# EAGLE schematic MMI (EAGLE 6.4)
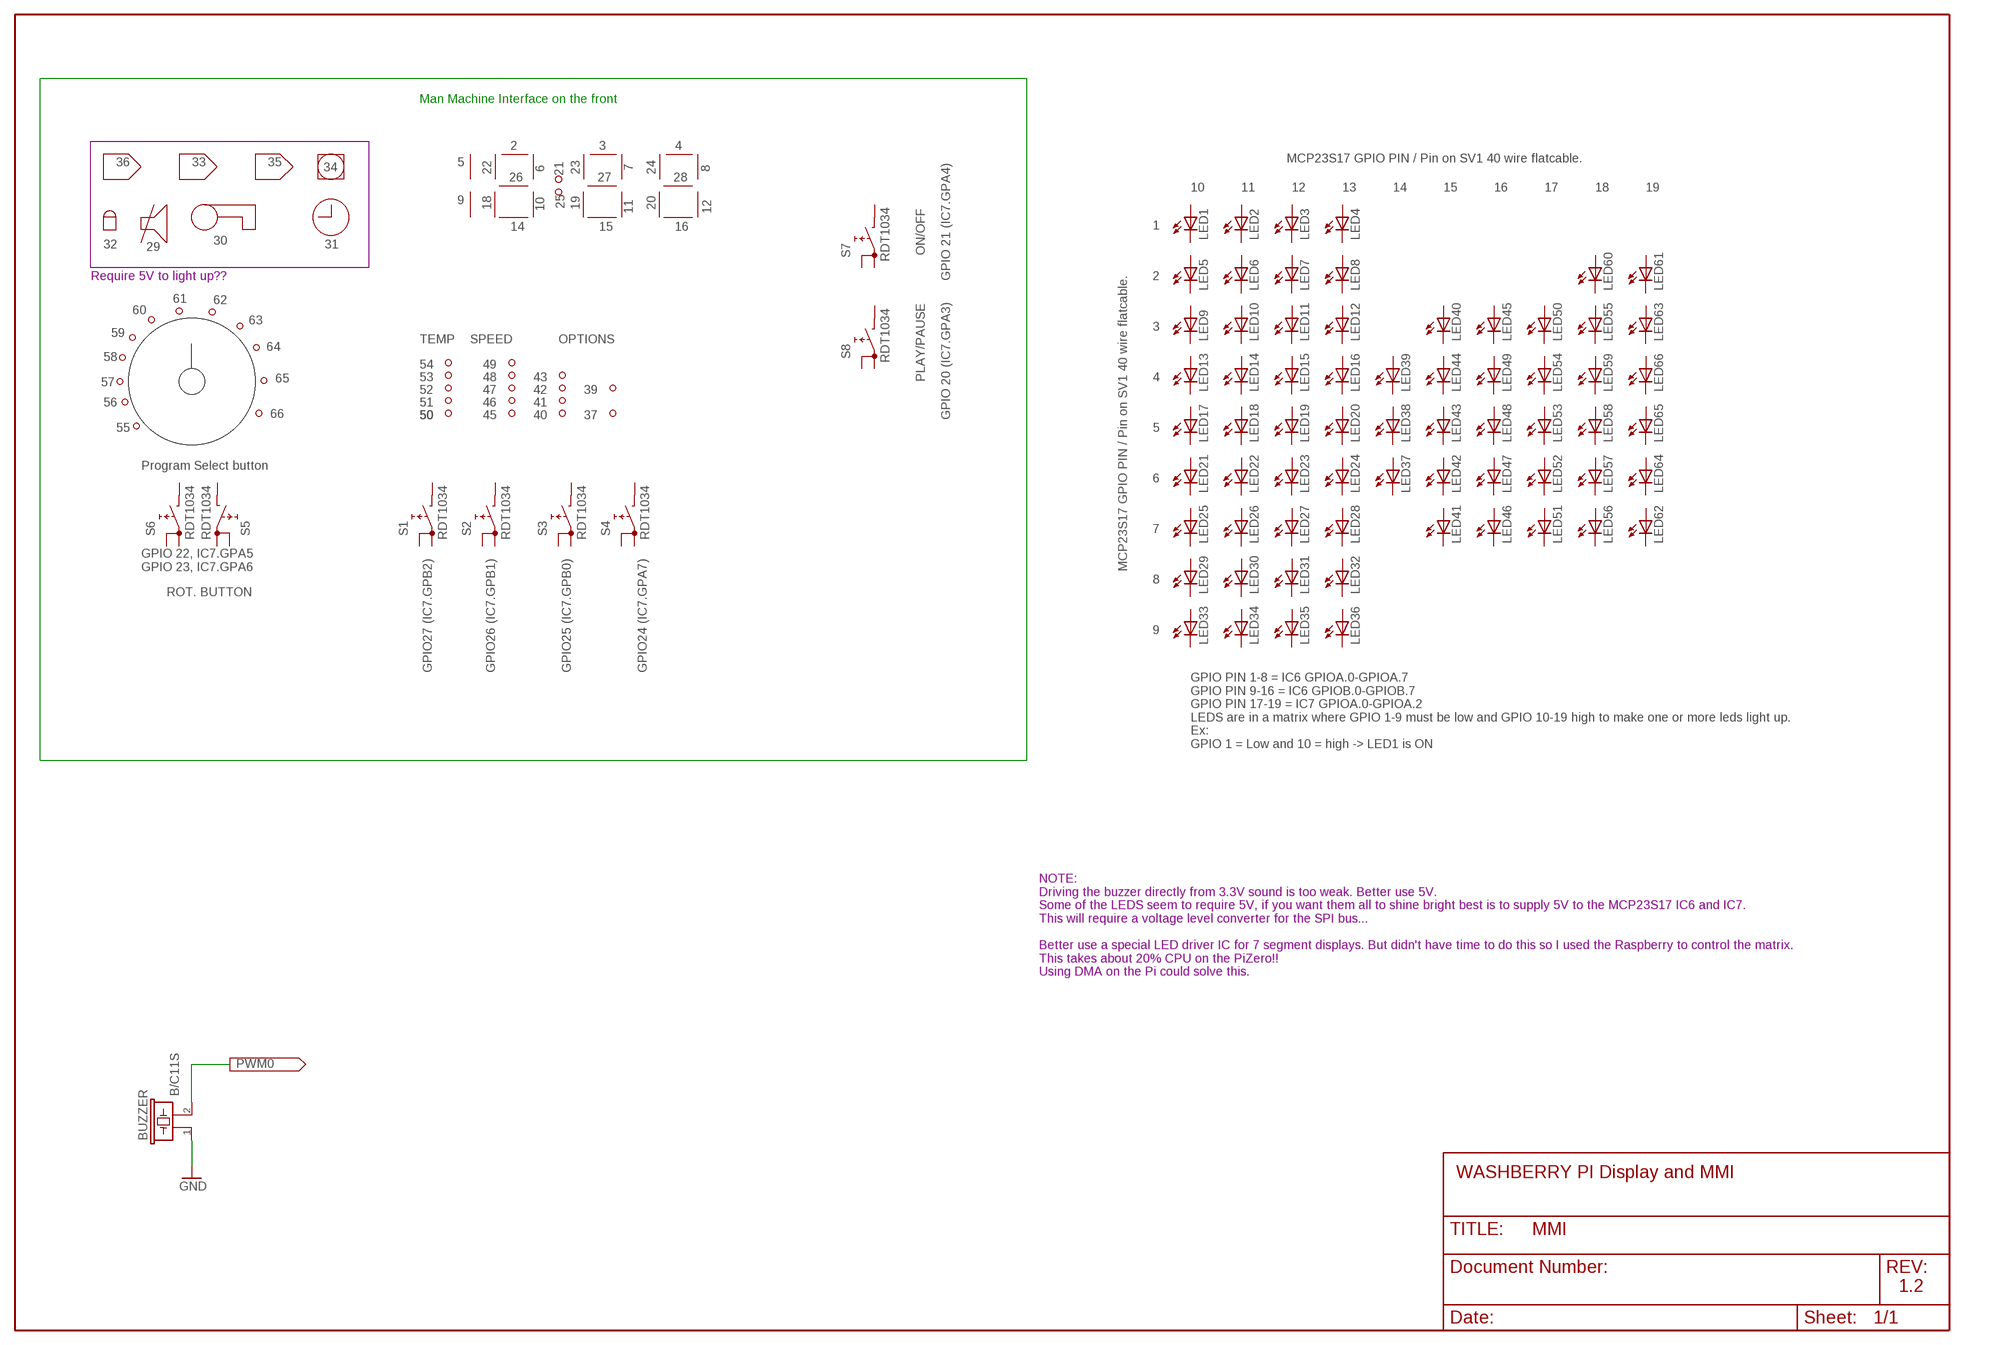
[diagram p0: schematic, sheet 1]

## Parts
BUZZER  B/C11S  [B/C11S]
LED1  LED3MM  [LED3MM]
LED2  LED3MM  [LED3MM]
LED3  LED3MM  [LED3MM]
LED4  LED3MM  [LED3MM]
LED5  LED3MM  [LED3MM]
LED6  LED3MM  [LED3MM]
LED7  LED3MM  [LED3MM]
LED8  LED3MM  [LED3MM]
LED9  LED3MM  [LED3MM]
LED10  LED3MM  [LED3MM]
LED11  LED3MM  [LED3MM]
LED12  LED3MM  [LED3MM]
LED13  LED3MM  [LED3MM]
LED14  LED3MM  [LED3MM]
LED15  LED3MM  [LED3MM]
LED16  LED3MM  [LED3MM]
LED17  LED3MM  [LED3MM]
LED18  LED3MM  [LED3MM]
LED19  LED3MM  [LED3MM]
LED20  LED3MM  [LED3MM]
LED21  LED3MM  [LED3MM]
LED22  LED3MM  [LED3MM]
LED23  LED3MM  [LED3MM]
LED24  LED3MM  [LED3MM]
LED25  LED3MM  [LED3MM]
LED26  LED3MM  [LED3MM]
LED27  LED3MM  [LED3MM]
LED28  LED3MM  [LED3MM]
LED29  LED3MM  [LED3MM]
LED30  LED3MM  [LED3MM]
LED31  LED3MM  [LED3MM]
LED32  LED3MM  [LED3MM]
LED33  LED3MM  [LED3MM]
LED34  LED3MM  [LED3MM]
LED35  LED3MM  [LED3MM]
LED36  LED3MM  [LED3MM]
LED37  LED3MM  [LED3MM]
LED38  LED3MM  [LED3MM]
LED39  LED3MM  [LED3MM]
LED40  LED3MM  [LED3MM]
LED41  LED3MM  [LED3MM]
LED42  LED3MM  [LED3MM]
LED43  LED3MM  [LED3MM]
LED44  LED3MM  [LED3MM]
LED45  LED3MM  [LED3MM]
LED46  LED3MM  [LED3MM]
LED47  LED3MM  [LED3MM]
LED48  LED3MM  [LED3MM]
LED49  LED3MM  [LED3MM]
LED50  LED3MM  [LED3MM]
LED51  LED3MM  [LED3MM]
LED52  LED3MM  [LED3MM]
LED53  LED3MM  [LED3MM]
LED54  LED3MM  [LED3MM]
LED55  LED3MM  [LED3MM]
LED56  LED3MM  [LED3MM]
LED57  LED3MM  [LED3MM]
LED58  LED3MM  [LED3MM]
LED59  LED3MM  [LED3MM]
LED60  LED3MM  [LED3MM]
LED61  LED3MM  [LED3MM]
LED62  LED3MM  [LED3MM]
LED63  LED3MM  [LED3MM]
LED64  LED3MM  [LED3MM]
LED65  LED3MM  [LED3MM]
LED66  LED3MM  [LED3MM]
S1  RDT1034  [RDT1034]
S2  RDT1034  [RDT1034]
S3  RDT1034  [RDT1034]
S4  RDT1034  [RDT1034]
S5  RDT1034  [RDT1034]
S6  RDT1034  [RDT1034]
S7  RDT1034  [RDT1034]
S8  RDT1034  [RDT1034]

## Nets
GND: BUZZER.1
N$1: BUZZER.2
Unconnected: LED1.A LED1.K(C) LED2.A LED2.K(C) LED3.A LED3.K(C) LED4.A LED4.K(C) LED5.A LED5.K(C) LED6.A LED6.K(C) LED7.A LED7.K(C) LED8.A LED8.K(C) LED9.A LED9.K(C) LED10.A LED10.K(C) LED11.A LED11.K(C) LED12.A LED12.K(C) LED13.A LED13.K(C) LED14.A LED14.K(C) LED15.A LED15.K(C) LED16.A LED16.K(C) LED17.A LED17.K(C) LED18.A LED18.K(C) LED19.A LED19.K(C) LED20.A LED20.K(C) LED21.A LED21.K(C) LED22.A LED22.K(C) LED23.A LED23.K(C) LED24.A LED24.K(C) LED25.A LED25.K(C) LED26.A LED26.K(C) LED27.A LED27.K(C) LED28.A LED28.K(C) LED29.A LED29.K(C) LED30.A LED30.K(C) LED31.A LED31.K(C) LED32.A LED32.K(C) LED33.A LED33.K(C) LED34.A LED34.K(C) LED35.A LED35.K(C) LED36.A LED36.K(C) LED37.A LED37.K(C) LED38.A LED38.K(C) LED39.A LED39.K(C) LED40.A LED40.K(C) LED41.A LED41.K(C) LED42.A LED42.K(C) LED43.A LED43.K(C) LED44.A LED44.K(C) LED45.A LED45.K(C) LED46.A LED46.K(C) LED47.A LED47.K(C) LED48.A LED48.K(C) LED49.A LED49.K(C) LED50.A LED50.K(C) LED51.A LED51.K(C) LED52.A LED52.K(C) LED53.A LED53.K(C) LED54.A LED54.K(C) LED55.A LED55.K(C) LED56.A LED56.K(C) LED57.A LED57.K(C) LED58.A LED58.K(C) LED59.A LED59.K(C) LED60.A LED60.K(C) LED61.A LED61.K(C) LED62.A LED62.K(C) LED63.A LED63.K(C) LED64.A LED64.K(C) LED65.A LED65.K(C) LED66.A LED66.K(C) S1.A S1.A1 S1.B S2.A S2.A1 S2.B S3.A S3.A1 S3.B S4.A S4.A1 S4.B S5.A S5.A1 S5.B S6.A S6.A1 S6.B S7.A S7.A1 S7.B S8.A S8.A1 S8.B

## Notes on the sheet
- Man Machine Interface on the front
- 2 | 3 | 4
- MCP23S17 GPIO PIN / Pin on SV1 40 wire flatcable.
- 36 | 33 | 35 | 5
- 34 | 6 | 7 | 8
- 22 | 21 | 23 | 24
- 26 | 27 | 28
- 10 | 11 | 12 | 13 | 14 | 15 | 16 | 17 | 18 | 19
- 9
- 18 | 10 | 25 | 19 | 20
- 11 | 12
- 14 | 15 | 16 | 1
- 30
- 32 | 29 | 31
- ON/OFF
- Require 5V to light up?? | GPIO 21 (IC7.GPA4) | 2
- 61 | 62
- 60
- 63
- 3
- 59
- TEMP | SPEED | OPTIONS
- 64
- 58
- 54 | 49
- 65 | 53 | 48 | 43 | PLAY/PAUSE | 4
- 57
- 52 | 47 | 42 | 39
- 56 | 51 | 46 | 41
- 66 | 50 | 50 | 45 | 40 | 37 | GPIO 20 (IC7.GPA3)
- 55 | 5
- Program Select button
- 6
- 7
- GPIO 22, IC7.GPA5
  GPIO 23, IC7.GPA6
- MCP23S17 GPIO PIN / Pin on SV1 40 wire flatcable.
- 8
- ROT. BUTTON
- 9
- GPIO27 (IC7.GPB2) | GPIO26 (IC7.GPB1) | GPIO25 (IC7.GPB0) | GPIO24 (IC7.GPA7)
- GPIO PIN 1-8 = IC6 GPIOA.0-GPIOA.7
  GPIO PIN 9-16 = IC6 GPIOB.0-GPIOB.7
  GPIO PIN 17-19 = IC7 GPIOA.0-GPIOA.2
  LEDS are in a matrix where GPIO 1-9 must be low and GPIO 10-19 high to make one or more leds light up.
  Ex:
  GPIO 1 = Low and 10 = high -> LED1 is ON
- NOTE:
  Driving the buzzer directly from 3.3V sound is too weak. Better use 5V.
  Some of the LEDS seem to require 5V, if you want them all to shine bright best is to supply 5V to the MCP23S17 IC6 and IC7.
  This will require a voltage level converter for the SPI bus...
  
  Better use a special LED driver IC for 7 segment displays. But didn't have time to do this so I used the Raspberry to control the matrix.
  This takes about 20% CPU on the PiZero!!
  Using DMA on the Pi could solve this.
- WASHBERRY PI Display and MMI
- 1.2

## Library data of the parts
BUZZER = buzzer:B/C11S: BUZZER Source: Buerklin; OC_FARNELL: unknown; OC_NEWARK: unknown
LED1-LED66 = led:LED: LED OSRAM: - CHIPLED LG R971, LG N971, LY N971, LG Q971, LY Q971, LO R971, LY R971 LH N974, LH R974 LS Q976, LO Q976, LY Q976 LO Q996 - Hyper CHIPLED LW Q18S LB Q993, LB Q99A, LB R99A - SideLED LS A670, LO A670, LY A670, LG A670, LP A670 LB A673, LV A673, LT A673, LW A673 LH A674 LY A675 LS A676, LA A676, LO A676, LY A676, LW A676 LS A679, LY A679, LG A679 - Hyper Micro SIDELED® LS Y876, LA Y876, LO Y876, LY Y876 LT Y87S - SmartLED LW L88C, LW L88S LB L89C, LB L89S, LG L890 LS L89K, LO L89K, LY L89K LS L896, LA L896, LO L896, LY L896 - TOPLED LS T670, LO T670, LY T670, LG T670, LP T670 LSG T670, LSP T670, LSY T670, LOP T670, LYG T670 LG T671, LOG T671, LSG T671 LB T673, LV T673, LT T673, LW T673 LH T674 LS T676, LA T676, LO T676, LY T676, LB T676, LH T676, LSB T676, LW T676 LB T67C, LV T67C, LT T67C, LS T67K, LO T67K, LY T67K, LW E67C LS E67B, LA E67B, LO E67B, LY E67B, LB E67C, LV E67C, LT E67C LW T67C LS T679, LY T679, LG T679 LS T770, LO T770, LY T770, LG T770, LP T770 LB T773, LV T773, LT T773, LW T773 LH T774 LS E675, LA E675, LY E675, LS T675 LS T776, LA T776, LO T776, LY T776, LB T776 LHGB T686 LT T68C, LB T68C - Hyper Mini TOPLED® LB M676 - Mini TOPLED Santana® LG M470 LS M47K, LO M47K, LY M47K Source: http://www.osram.convergy.de LUXEON: - LUMILED® LXK2-PW12-R00, LXK2-PW12-S00, LXK2-PW14-U00, LXK2-PW14-V00 LXK2-PM12-R00, LXK2-PM12-S00, LXK2-PM14-U00 LXK2-PE12-Q00, LXK2-PE12-R00, LXK2-PE12-S00, LXK2-PE14-T00, LXK2-PE14-U00 LXK2-PB12-K00, LXK2-PB12-L00, LXK2-PB12-M00, LXK2-PB14-N00, LXK2-PB14-P00, LXK2-PB14-Q00 LXK2-PR12-L00, LXK2-PR12-M00, LXK2-PR14-Q00, LXK2-PR14-R00 LXK2-PD12-Q00, LXK2-PD12-R00, LXK2-PD12-S00 LXK2-PH12-R00, LXK2-PH12-S00 LXK2-PL12-P00, LXK2-PL12-Q00, LXK2-PL12-R00 Source: www.luxeon.com KINGBRIGHT: KA-3528ASYC Source: www.kingbright.com
S1-S8 = switch:RDT1034: PUSH SWITCH www.radiohm.com